# Altium schematic sheet NDP2450KC1_NDP2450KC.schdoc
size 124 x 99 mm
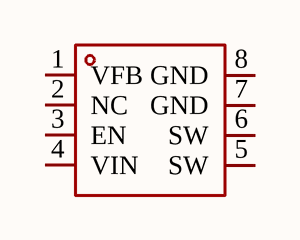
[diagram p0: NDP2450KC1_NDP2450KC.schdoc]

## Parts
U?  NDP2450KC  [SOP-8_L4.9-W3.9-P1.27-LS6.0-BL]  (value not drawn)

## Nets

Not connected (* = marked no-connect by the designer): U? 1(VFB) 2(NC) 3(EN) 4(VIN) 5(SW) 6(SW) 7(GND) 8(GND)

## Library data of the parts
U? = NDP2450KC: Manufacturer: NDP(芯潭微); Add into BOM: yes; Function: 降压型; Output Type: 可调; Input Voltage: 5.5V~40V; Output Current: 5A; Switching Frequency: 300kHz; Number of Outputs: 1; Topology: 降压式; Quiescent Current (Iq): 1.3mA; Switch tube (built-in/external): 内置; Symbol: NDP2450KC; Device: NDP2450KC; LCSC Part Name: 高效同步降压DC/DC转换器; Supplier Part: C7420594; Manufacturer Part: NDP2450KC; Supplier Footprint: SOP-8; JLCPCB Part Class: Extended Part; Datasheet: https://atta.szlcsc.com/upload/public/pdf/source/20241223/8636749DAA6B1A5E6731A1AFEB5B6D25.pdf; Supplier: LCSC; Convert to PCB: yes; Output Voltage: -; Operating Temperature: -40℃~+150℃; Synchronous Rectification: -